# EasyEDA Pro project sonos_knobs_v1.1.eprj, board PCB5_1
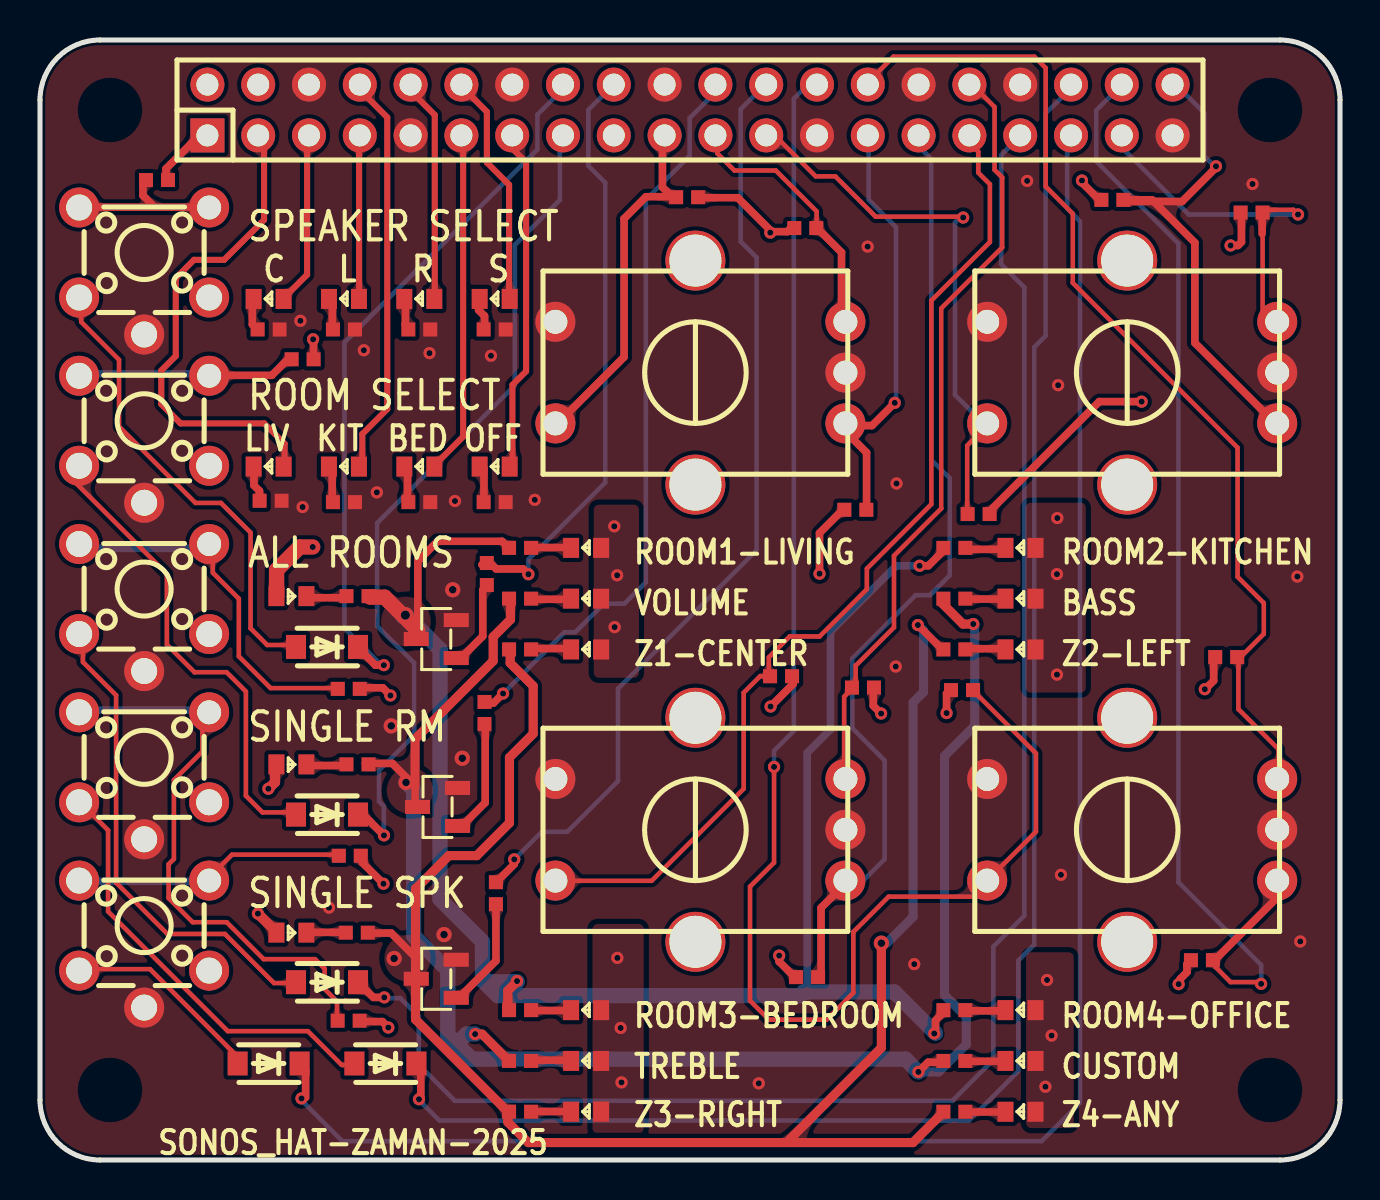
[diagram p2: board, top side]
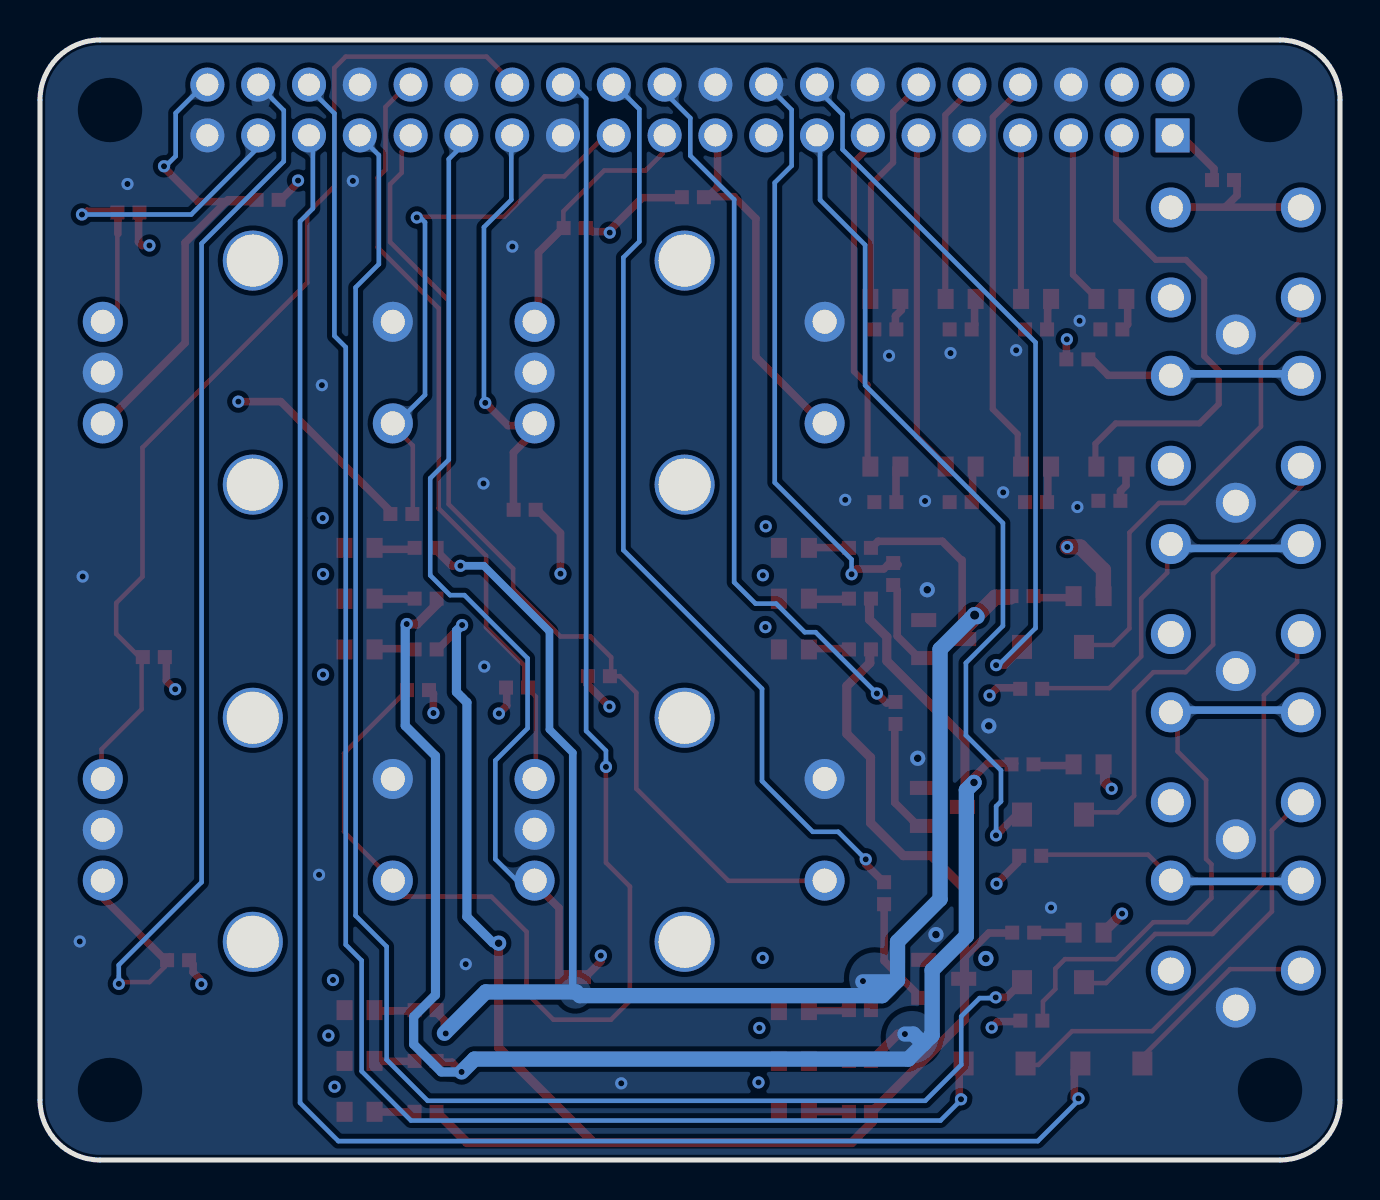
[diagram p3: board, bottom side, seen from below]

Outline 65 x 56 mm; copper layers: Top Layer, Inner1, Inner2, Bottom Layer. Coordinates in mm from the lower left corner of the outline.
Outline path: 0,53 0,3 arc(0.88,0.88) 3,0 62,0 arc(64.12,0.88) 65,3 65,53 arc(64.12,55.12) 62,56 3,56 arc(0.88,55.12) 0,53
Stack: Top Layer 0.035mm Outer layer thickness 1oz / Dielectric1 0.2104mm 7628 RC49% 8.6mil / Inner1 0.0152mm Inner layer thickness / Dielectric2 1.065mm 1.1mm H/HOZ Copper / Inner2 0.0152mm Inner layer thickness / Dielectric3 0.2104mm 7628 RC49% 8.6mil / Bottom Layer 0.035mm Outer layer thickness 1oz

## Design rules (mm)
template: Custom Config
spacing copperThickness1oz (default): track to track 0.102, other pairs 0.152 to 0.3
spacing copperThickness2oz: track to track 0.203, other pairs 0.152 to 0.3
track width copperThickness1oz (default): min 0.127, default 0.381, max 2.54
track width copperThickness2oz: min 0.203, default 0.254, max 2.54
differential pair differentialPair (default): width min 0.127, default 0.254, max 2.54; gap min 0.152, default 0.152
via viaSize (default): diameter min 0.5, default 0.61, max 10; hole min 0.3, default 0.305, max 6.299
net GND uses copperRegion2
pour e5335 uses copperRegion2

## Placement (name value [footprint] x y rotation side)
D1  SM4007PL  [SOD-123F_L2.8-W1.8-LS3.7-RD]  14.35 25.65 180 top
D2  SM4007PL  [SOD-123F_L2.8-W1.8-LS3.7-RD]  14.35 17.27 180 top
D3  SM4007PL  [SOD-123F_L2.8-W1.8-LS3.7-RD]  14.35 8.89 180 top
D4  SM4007PL  [SOD-123F_L2.8-W1.8-LS3.7-RD]  17.27 4.83 180 top
D5  SM4007PL  [SOD-123F_L2.8-W1.8-LS3.7-RD]  11.43 4.83 180 top
H1  2.54-2*20P母长PC104  [HDR-TH_40P-P2.54-V-F-R2-C20-S2.54-2]  32.5 52.5 0 top
LED1  KT-0603R  [LED0603-RD]  12.57 28.19 180 top
LED2  KT-0603R  [LED0603-RD]  27.31 30.61 0 top
LED3  KT-0603R  [LED0603-RD]  49.02 30.61 0 top
LED4  KT-0603R  [LED0603-RD]  27.31 7.49 0 top
LED5  KT-0603R  [LED0603-RD]  49.02 7.49 0 top
LED6  KT-0603R  [LED0603-RD]  12.57 19.78 180 top
LED7  KT-0603R  [LED0603-RD]  27.31 28.07 0 top
LED8  KT-0603R  [LED0603-RD]  49.02 28.07 0 top
LED9  KT-0603R  [LED0603-RD]  27.31 4.95 0 top
LED10  KT-0603R  [LED0603-RD]  49.02 4.95 0 top
LED11  KT-0603R  [LED0603-RD]  12.57 11.37 180 top
LED12  KT-0603R  [LED0603-RD]  27.31 25.53 0 top
LED13  KT-0603R  [LED0603-RD]  49.02 25.53 0 top
LED14  KT-0603R  [LED0603-RD]  27.31 2.41 0 top
LED15  KT-0603R  [LED0603-RD]  49.02 2.41 0 top
LED16  KT-0603R  [LED0603-RD]  11.43 43.05 0 top
LED17  KT-0603R  [LED0603-RD]  15.2 43.05 0 top
LED18  KT-0603R  [LED0603-RD]  18.97 43.05 0 top
LED19  KT-0603R  [LED0603-RD]  22.73 43.05 0 top
LED20  KT-0603R  [LED0603-RD]  11.43 34.67 0 top
LED21  KT-0603R  [LED0603-RD]  15.2 34.67 0 top
LED22  KT-0603R  [LED0603-RD]  18.97 34.67 0 top
LED23  KT-0603R  [LED0603-RD]  22.73 34.67 0 top
Q1  MMBT2222A 1P  [SOT-23-3_L2.9-W1.3-P1.90-LS2.4-BR]  19.81 26.05 0 top
Q2  MMBT2222A 1P  [SOT-23-3_L2.9-W1.3-P1.90-LS2.4-BR]  19.88 17.65 0 top
Q3  MMBT2222A 1P  [SOT-23-3_L2.9-W1.3-P1.90-LS2.4-BR]  19.81 9.06 0 top
R3  10kΩ  [C0402]  40.77 32.51 0 top
R4  10kΩ  [C0402]  38.26 46.6 0 top
R7  10kΩ  [C0402]  53.62 48.01 180 top
R8  10kΩ  [C0402]  60.58 47.37 180 top
R11  10kΩ  [C0402]  38.35 9.14 0 top
R12  10kΩ  [C0402]  41.15 23.62 180 top
R15  10kΩ  [C0402]  58.1 9.99 180 top
R16  10kΩ  [C0402]  59.31 25.15 180 top
R18  390Ω  [C0402]  22.34 29.3 270 top
R19  200Ω  [C0402]  15.88 28.19 180 top
R20  200Ω  [C0402]  24 30.61 0 top
R21  200Ω  [C0402]  45.72 30.61 0 top
R22  200Ω  [C0402]  24 7.49 0 top
R23  200Ω  [C0402]  45.72 7.49 0 top
R24  390Ω  [C0402]  22.22 22.35 270 top
R25  200Ω  [C0402]  15.88 19.78 180 top
R26  200Ω  [C0402]  24 28.07 0 top
R27  200Ω  [C0402]  45.72 28.07 0 top
R28  200Ω  [C0402]  24 4.95 0 top
R29  200Ω  [C0402]  45.72 4.95 0 top
R30  390Ω  [C0402]  22.8 13.34 270 top
R31  200Ω  [C0402]  15.84 11.37 180 top
R32  200Ω  [C0402]  24 25.53 0 top
R33  200Ω  [C0402]  45.72 25.53 0 top
R34  200Ω  [C0402]  24 2.41 0 top
R35  200Ω  [C0402]  45.72 2.41 0 top
R36  120Ω  [C0402]  11.43 41.53 180 top
R37  120Ω  [C0402]  15.2 41.53 180 top
R38  120Ω  [C0402]  18.97 41.53 180 top
R39  120Ω  [C0402]  22.73 41.53 180 top
R40  120Ω  [C0402]  11.53 32.96 180 top
R41  120Ω  [C0402]  15.2 32.89 180 top
R42  120Ω  [C0402]  18.97 32.89 180 top
R43  120Ω  [C0402]  22.73 32.89 180 top
R44  1kΩ  [C0402]  5.85 49 180 top
R45  1kΩ  [C0402]  13.13 40.04 180 top
R46  1kΩ  [C0402]  15.44 23.56 180 top
R48  1kΩ  [C0402]  15.43 6.97 180 top
R49  1kΩ  [C0402]  15.49 15.21 180 top
R50  1kΩ  [C0402]  32.36 48.14 0 top
R51  1kΩ  [C0402]  46.93 32.3 0 top
R52  1kΩ  [C0402]  37.05 24.19 0 top
R53  1kΩ  [C0402]  46.1 23.5 180 top
SW1  PEC12R-4230F-S0024  [SW-TH_PEC12R-4230F-S0024]  33.02 39.37 90 top
SW2  PEC12R-4230F-S0024  [SW-TH_PEC12R-4230F-S0024]  54.61 39.37 90 top
SW3  PEC12R-4230F-S0024  [SW-TH_PEC12R-4230F-S0024]  33.02 16.51 90 top
SW4  PEC12R-4230F-S0024  [SW-TH_PEC12R-4230F-S0024]  54.61 16.51 90 top
SW5  SKHHQVA010  [SW-TH_5P-L6.0-W6.0-P4.50-LS6.5]  5.21 10.8 0 top
SW6  SKHHQVA010  [SW-TH_5P-L6.0-W6.0-P4.50-LS6.5]  5.21 19.21 0 top
SW7  SKHHQVA010  [SW-TH_5P-L6.0-W6.0-P4.50-LS6.5]  5.21 27.62 0 top
SW8  SKHHQVA010  [SW-TH_5P-L6.0-W6.0-P4.50-LS6.5]  5.21 36.04 0 top
SW9  SKHHQVA010  [SW-TH_5P-L6.0-W6.0-P4.50-LS6.5]  5.21 44.45 0 top

## Footprints (pads in the part's own frame, mm; a bottom-side part is the same pattern mirrored in y, then rotated)
C0402
  rect 0.7x0.7 smd: 1(-0.55,0) 2(0.55,0)
HDR-TH_40P-P2.54-V-F-R2-C20-S2.54-2
  rect 1.7x1.7 hole 1.1: 1(-24.13,-1.27)
  round 1.7 hole 1.1: 2(-24.13,1.27) 3(-21.59,-1.27) 4(-21.59,1.27) 5(-19.05,-1.27) 6(-19.05,1.27) 7(-16.51,-1.27) 8(-16.51,1.27) 9(-13.97,-1.27) 10(-13.97,1.27) 11(-11.43,-1.27) 12(-11.43,1.27) 13(-8.89,-1.27) 14(-8.89,1.27) 15(-6.35,-1.27) 16(-6.35,1.27) 17(-3.81,-1.27) 18(-3.81,1.27) 19(-1.27,-1.27) 20(-1.27,1.27) 21(1.27,-1.27) 22(1.27,1.27) 23(3.81,-1.27) 24(3.81,1.27) 25(6.35,-1.27) 26(6.35,1.27) 27(8.89,-1.27) 28(8.89,1.27) 29(11.43,-1.27) 30(11.43,1.27) 31(13.97,-1.27) 32(13.97,1.27) 33(16.51,-1.27) 34(16.51,1.27) 35(19.05,-1.27) 36(19.05,1.27) 37(21.59,-1.27) 38(21.59,1.27) 39(24.13,-1.27) 40(24.13,1.27)
LED0603-RD
  rect 0.8x1 smd: 1(-0.75,0) 2(0.75,0)
SOD-123F_L2.8-W1.8-LS3.7-RD
  rect 1x1.2 smd: 1(-1.55,0) 2(1.55,0)
SOT-23-3_L2.9-W1.3-P1.90-LS2.4-BR
  rect 1.25x0.7 smd: 1(1,-0.95) 2(1,0.95) 3(-1,0)
SW-TH_5P-L6.0-W6.0-P4.50-LS6.5
  round 2 hole 1.3: 1(-3.25,3.175) 3(-3.25,-1.325) 4(3.25,-1.325) 5(0.002,-3.175)
  round 2 hole 1.199: 2(3.25,3.175)
SW-TH_PEC12R-4230F-S0024
  round 2 hole 1.2: 1(-2.54,7.25) 2(2.54,7.25) A(-2.54,-7.25) B(2.54,-7.25) C(0,-7.25)
  round 3 hole 2.6: 6(-5.601,0.25) 7(5.601,0.25)

## Nets
As in the schematic.

Pads without a net: SW1 6 7; SW2 6 7; SW3 6 7; SW4 6 7; SW5 4; SW6 4; SW7 4; SW8 4; SW9 4

## Via types
v1: diameter 0.61, hole 0.305, Top Layer to Bottom Layer, 71 vias
v2: diameter 0.762, hole 0.381, Top Layer to Bottom Layer, 7 vias
v3: diameter 0.813, hole 0.457, Top Layer to Bottom Layer, 1 via

## Routing (per net, layer and track width the routed paths; a pad name or vN(x,y) marks a point on that pad's centre or on a via; arc(x,y) is an arc through that point)
+3.3V: length 63.5
  Top Layer w0.381: 60.07,47.31 60.07,45.9 59.9,45.73 v1(59.53,45.73) ; 16.07,6.92 17.12,6.92 v1(17.42,6.62) ; 41.66,23.57 41.66,22.72 v1(42.06,22.32) ; 47.48,32.43 52.96,37.92 v1(55.08,37.92) ; 37.78,9.1 36.96,9.92 v1(36.96,10.22) ; v1(52.1,48.97) 52.1,48.87 52.91,48.06 ; 58.27,23.55 58.68,23.97 58.68,25.11 ; 36.58,46.42 37.36,46.42 37.59,46.64 ; 36.58,46.42 36.58,46.38 ; 36.58,46.42 34.89,48.11 32.94,48.11 32.92,48.09 ; 40.05,32.43 38.98,31.35 v1(38.98,29.32) ; v1(36.53,22.67) 37.66,23.81 37.66,24.22 37.65,24.23 ; 13.62,40.94 13.68,40.88 13.68,40.09 ; 57.01,8.81 57.01,9.05 57.35,9.39 57.35,9.79 57.5,9.94 ; 16.11,15.23 16.11,14.87 v1(17.17,13.81) ; v1(45.33,22.35) 45.33,23.32 45.49,23.49 ; 16,23.61 17.14,23.61 v1(17.52,23.23) ; 6.3,48.95 6.3,49.57 7.75,51.01 8.12,51.01
  Inner2 w0.94: 8.45,51.23 8.45,50.79 11.26,47.97 25.62,47.97 28.66,51.02 28.66,51.18
  vias: v1(13.66,41.04) v1(36.51,46.37) v1(56.93,8.79) v1(58.24,23.54)
+5V: length 6.2
  Top Layer w0.508: v1(10.9,12.32) 11.71,11.5 11.71,11.36 ; v1(11.42,18.56) 11.75,18.89 11.75,19.68
  Top Layer w0.762: v1(13.64,30.65) 12.98,30.65 11.83,29.5 11.83,28.14
  vias: v1(28.71,31.69) v1(28.73,26.64) v1(28.86,29.24) v1(28.87,10.11) v1(29.03,6.6) v1(29.07,3.88) v1(50.27,3.66) v1(50.35,9) v1(50.58,6.22) v1(50.85,29.29) v1(50.85,24.27) v1(50.87,32.1)
GND:
  vias: v1(13.02,41.96) v1(13.13,32.65) v1(14.45,12.62) v1(16.19,40.49) v1(16.84,33.38) v1(19.47,40.34) v1(20.75,32.95) v1(22.55,40.21) v1(24.74,33.01) v1(35.94,3.83) v1(41.38,45.67) v1(42.83,33.83) v1(42.79,24.67) v1(43.71,9.79) v1(49.36,48.95) v1(50.91,38.74) v1(51.05,14.26) v1(60.63,48.8) v1(62.87,29.17) v1(63.01,10.93) v2(17.56,21.71) v2(20.2,11.27) v2(20.64,28.51) v2(21.11,20.09)
ALL_ROOM_LED: length 29.8
  Top Layer w0.381: v1(24.42,29.29) 24.16,29.55 22.81,29.55 22.6,29.77 22.1,29.77 22.24,29.91 22.42,29.91
  Bottom Layer w0.229: 28.42,53.84 28.26,53.68 28.26,53.35 27.42,52.51 27.42,49.71 28.26,48.87 28.26,33.87 24.42,30.03 v1(24.42,29.29)
CLK_BASS: length 47
  Top Layer w0.381: 40.28,13.84 39.05,12.61 39.05,9.24
  Bottom Layer w0.229: 43.64,50.97 44.56,50.05 44.56,35.02 45.49,34.09 45.49,29.23 44.5,28.24 43.78,28.24 40.62,25.08 40.62,21.59 42.23,19.97 42.23,15.05 40.88,13.7 40.69,13.7
CLK_EXTRA: length 57
  Top Layer w0.229: 61.09,8.77 60.96,8.9 59.53,8.9 58.76,9.66 58.76,9.98
  Top Layer w0.381: 62.02,13.61 62.02,13.28 58.71,9.97 58.52,10.16
  Bottom Layer w0.229: 61.06,8.66 61.06,9.75 56.92,13.89 56.92,45.82 52.81,49.93 52.81,52.48 53.81,53.48
  vias: v1(61.06,8.81)
CLK_TREB: length 25.9
  Top Layer w0.381: 55.69,47.92 55.6,48.01 54.39,48.01 ; 55.69,47.92 54.47,47.92 54.39,48.01 ; 55.69,47.92 57.74,45.87 57.74,40.85 61.96,36.64 ; 55.69,47.92 57.1,47.92 58.82,49.64 58.82,49.71 ; 54.05,47.99 54.07,48.01 54.39,48.01 ; 54.39,48.01 54.38,48.02
  Bottom Layer w0.229: 56.77,53.79 58.22,52.35 58.22,50.19 58.81,49.6
  vias: v1(58.8,49.69)
CLK_VOL: length 21.4
  Top Layer w0.381: v1(42.74,37.86) 41.6,36.72 40.34,36.72 ; 40.48,36.22 41.33,35.37 41.33,32.5
  Bottom Layer w0.229: 41.37,51.66 41.44,51.59 41.44,48.01 42.8,46.64 42.8,37.92 v1(42.74,37.86)
DT_BASS: length 38.2
  Top Layer w0.229: 46.74,53.63 47.73,52.65 47.73,49.51 48.11,49.12 48.11,45.63 45.06,42.58 45.06,32.58 42.7,30.21 42.7,26.63 40.78,24.72 40.78,23.85 40.55,23.62 ; 40.6,23.55 40.21,23.16 40.21,19.23
DT_EXTRA: length 50.8
  Top Layer w0.229: 41.72,54.22 42.67,55.17 49.72,55.17 50.29,54.6 50.29,48.67 51.64,47.32 51.64,43.86 59.88,35.62 59.88,29.16 61.19,27.85 61.19,26.31 59.97,25.09 ; 59.88,25.22 59.92,25.18 59.92,22.54 61.92,20.54 61.92,19.02
DT_TREB: length 18.1
  Top Layer w0.229: v1(62.9,47.28) 62.67,47.51 61.22,47.51 ; 61.65,42 61.46,42 61.13,42.33 61.13,46.22
  Top Layer w0.381: 61.11,46.32 61.11,47.34 61.09,47.35
  Bottom Layer w0.229: 54.07,51.18 54.07,50.64 57.44,47.28 v1(62.9,47.28)
DT_VOL: length 12.3
  Top Layer w0.229: 33.87,50.74 33.87,50.33 34.72,49.47 36.79,49.47 38.83,47.43 38.83,46.53
  Top Layer w0.381: 38.85,46.61 40.08,45.38 40.08,42.31
ROOM1_LED: length 24.4
  Top Layer w0.305: 11.02,51.05 11.2,50.87 11.2,47 9.21,45.01 7.7,45.01 6.79,44.1 6.79,40.2 6.06,39.48 6.06,37.79 7.03,36.83 11.21,36.83 12.23,35.81 12.23,34.74
ROOM2_LED: length 20.2
  Top Layer w0.305: 16.14,53.89 16.14,53.35 17.36,52.13 17.36,37.55 16.12,36.3 16.12,34.72
ROOM3_LED: length 17.3
  Top Layer w0.305: 19.57,34.59 21.16,36.17 21.16,51.26
ROOM4_LED: length 17.4
  Top Layer w0.305: 23.62,51.32 23.62,50.57 24.31,49.89 24.31,39.44 23.62,38.75 23.62,34.75 23.46,34.59
SINGLE_ROOM_LED: length 46.8
  Top Layer w0.381: v1(23.71,15.03) 23.71,14.79 22.66,13.74
  Bottom Layer w0.229: v1(23.71,15.03) 25.09,16.41 26.36,16.41 28.9,18.95 28.9,23.56 35.83,30.5 35.83,45.13 35.03,45.92 35.03,52.54 36.07,53.58
SINGLE_SPK_LED: length 36.2
  Top Layer w0.381: v1(23.15,23.32) 22.68,22.86 22.26,22.86
  Bottom Layer w0.229: 33.58,53.2 32.49,52.1 32.49,50.22 30.29,48.02 30.29,28.89 29.22,27.82 28.19,27.82 26.76,26.39 26.22,26.39 v1(23.15,23.32)
SPK1_LED: length 8.7
  Top Layer w0.305: 13.35,51.21 13.35,44.27 12.15,43.06
SPK2_LED: length 8
  Top Layer w0.305: 15.96,43.09 15.96,50.86 16.14,51.05
SPK3_LED: length 10.9
  Top Layer w0.305: 18.5,53.57 18.5,53.48 19.74,52.25 19.74,43.44 19.57,43.28 19.57,43.25
SPK4_LED: length 11.5
  Top Layer w0.305: 21.26,53.49 22.34,52.41 22.34,49.87 23.45,48.76 23.45,43.23 23.7,42.98
SW_ALL_ROOM: length 35.6
  Top Layer w0.381: v1(17.19,24.74) 16.77,24.74 15.93,25.58
  Bottom Layer w0.229: 25.88,53.46 25.88,53.28 24.87,52.27 24.87,50.53 15.22,40.88 15.22,26.6 17.15,24.67
SW_BASS: length 49.6
  Top Layer w0.229: 36.44,24.19 36.47,24.19 ; 36.44,24.19 36.01,24.19 35.18,23.37 35.18,18.56 30.58,13.96 26.04,13.96 ; 36.44,24.19 36.44,25.13 37.49,26.18 38.98,26.18 41.34,28.54 41.34,29.57 44.57,32.79 44.57,42.97 47.49,45.9 47.49,48.79 46.91,49.37 46.91,50.42 46.78,50.55
SW_CHG_ROOM: length 90.7
  Top Layer w0.381: 13.05,4.7 13.28,4.47 13.28,3.12
  Bottom Layer w0.229: 13.08,2.98 15.11,0.94 50.08,0.94 52,2.86 52,46.93 51.36,47.58 51.36,50.68 51.6,50.92
  vias: v1(13.08,3.08)
SW_CHG_SPK: length 83.2
  Top Layer w0.381: 18.84,4.68 19.04,4.48 19.04,3.14
  Bottom Layer w0.229: 18.75,3.11 18.84,3.11 19.97,1.97 46.45,1.97 48.92,4.44 48.92,9.97 49.71,10.77 49.71,40.64 50.28,41.21 50.28,52.33 51.29,53.34 51.29,53.42
  vias: v1(18.95,3.04)
SW_EXTRA: length 75.9
  Top Layer w0.229: 46.71,23.41 49.8,20.33 49.8,16.42 47.38,14 ; v1(36.7,19.66) 36.7,14.87 35.5,13.67 35.5,7.96 36.45,7.02 39.33,7.02 40.67,8.36 40.67,11.41 42.43,13.17 46.89,13.17 47.46,13.73 47.46,13.83
  Bottom Layer w0.229: v1(36.7,19.66) 36.7,20.46 37.69,21.46 37.69,53.07 38.55,53.93
SW_SINGLE_ROOM: length 83.6
  Top Layer w0.381: v1(17.21,8.13) 16.67,8.13 15.98,8.82
  Bottom Layer w0.229: 17.3,8.09 18.02,8.09 18.94,7.18 18.94,4.76 20.74,2.96 45.62,2.96 47.67,5.01 47.67,10.67 49.22,12.22 49.22,43.63 48.06,44.79 48.06,50.24 48.75,50.94
SW_SINGLE_SPK: length 42.1
  Top Layer w0.381: v1(17.2,16.23) 16.07,17.36 15.91,17.36
  Bottom Layer w0.229: 17.19,16.26 17.19,17.69 16.95,17.93 16.95,19.48 18.7,21.23 18.7,24.86 16.85,26.71 16.85,31.85 23.74,38.74 23.74,45.75 26,48.01 26,51.2
SW_TREB: length 27.2
  Top Layer w0.229: 46.18,47.17 41.78,47.17 39.77,49.18 38.79,49.18 37.05,50.92 36.33,50.92 ; 46.36,32.34 46.36,35.72 47.25,36.62
  Bottom Layer w0.229: 46.01,47.14 45.75,46.89 45.75,38.25 47.29,36.72
  vias: v1(46.16,47.12)
SW_VOL: length 17.5
  Top Layer w0.381: 31.12,50.79 31.12,48.64 31.6,48.16 ; 25.81,36.76 29.2,40.15 29.2,47.07 30.3,48.16 31.6,48.16 ; 31.6,48.16 31.68,48.09
$2N553: length 4.3
  Top Layer w0.381: 22.42,28.77 22.14,28.49 22.14,26.19 21,25.05
$2N557: length 86
  Top Layer w0.381: 44.78,6.32 44.78,6.98 45.14,7.34 ; 23.44,30.6 23.1,30.94 19.88,30.94 18.95,30.01 ; v1(43.98,29.71) 44.42,29.71 45.18,30.47 ; 18.89,30.01 18.89,26.05
  Top Layer w0.457: 23.39,7.59 23.39,8.46 23.87,8.95
  Top Layer w0.762: 18.89,26.48 17.23,28.14 16.51,28.14
  Bottom Layer w0.381: 38.36,8.35 38.36,20.36 39.53,21.53 39.53,26.43 42.81,29.71 v1(43.98,29.71)
  Bottom Layer w0.762: 18.31,27.23 20,25.54 20,13.04 22.12,10.92 22.12,8.98 22.89,8.22 38,8.22 38.19,8.4 42.71,8.4 44.78,6.34 ; 18.2,27.23 18.14,27.17 ; 22.36,8.91 23.86,8.91
  vias: v1(23.85,8.95) v1(44.71,6.32) v3(18.27,27.25)
$2N567: length 2
  Top Layer w0.381: 15.3,28.11 13.29,28.11
$2N579: length 2.1
  Top Layer w0.381: 24.48,30.61 24.49,30.62 26.58,30.62
$2N581: length 2.1
  Top Layer w0.381: 48.28,30.53 46.3,30.53 46.19,30.64
$2N583: length 2.1
  Top Layer w0.381: 24.56,7.47 26.57,7.47 26.64,7.4
$2N585: length 1.9
  Top Layer w0.381: 48.22,7.44 48.2,7.46 46.29,7.46
$2N1083: length 5.9
  Top Layer w0.381: 22.26,21.92 22.26,17.87 20.97,16.58
$2N1087: length 85.2
  Top Layer w0.381: 45.15,4.89 44.41,4.89 v1(43.92,4.4) ; 18.75,17.63 18.75,18.69 17.61,19.83 16.26,19.83
  Top Layer w0.457: 18.75,18.69 18.75,21.05 22.66,24.95 22.66,26.16 23.53,27.02 23.53,28.1 ; v1(46.66,26.8) 46.14,26.8 45.11,27.83 45.11,28.06 ; v1(21.75,6.3) 22.1,6.3 23.33,5.07
  Bottom Layer w0.457: v1(46.66,26.8) 46.74,26.73 46.74,21.72 45.23,20.2 45.23,8.25 46.32,7.16 46.32,5.78 44.93,4.4 v1(43.92,4.4)
  Bottom Layer w0.762: 20.83,5.8 21.33,6.3 v1(21.75,6.3) ; 20.83,5.8 21.59,5.05 43.28,5.05 v1(43.92,4.4) ; 20.83,5.8 20.46,6.17 ; 20.46,6.17 20.39,6.24 20.39,9.49 18.68,11.2 18.68,18.5 v2(18.3,18.88) ; 20.46,6.17 20.46,6.24
$2N1097: length 2.1
  Top Layer w0.381: 13.29,19.72 15.27,19.72 15.33,19.78
$2N1109: length 2
  Top Layer w0.381: 24.52,27.98 24.57,28.04 26.41,28.04 26.49,28.12
$2N1111: length 1.9
  Top Layer w0.381: 48.25,28.05 46.37,28.05
$2N1113: length 2.1
  Top Layer w0.381: 26.54,4.99 24.54,4.99 24.51,4.96
$2N1115: length 2
  Top Layer w0.381: 46.29,4.94 48.27,4.94
$2N1613: length 5.5
  Top Layer w0.381: 22.8,12.85 22.8,9.96 20.95,8.11
$2N1617: length 85.6
  Top Layer w0.381: 45.18,25.57 45.07,25.57 v1(43.9,26.75) ; 18.78,10.13 17.56,11.35 16.43,11.35
  Top Layer w0.457: 18.8,13.58 20.44,15.22 21.84,15.22 23.47,16.85 23.47,20.13 24.66,21.31 24.66,23.7 23.51,24.85 23.51,25.61 23.52,25.62 ; v2(42.07,10.84) 42.07,5.61 37.41,0.96 ; 45.18,2.4 43.65,0.87 24.41,0.87 23.39,1.89 23.39,2.34 ; 18.78,13.58 18.78,7.02 ; 23.42,2.38 18.78,7.02
  Bottom Layer w0.457: v1(43.9,26.75) 44.18,26.47 44.18,23.4 43.65,22.88 43.65,12.16 42.36,10.86 42.09,10.86 v2(42.07,10.84)
  vias: v2(17.71,10.07)
$2N1627: length 2
  Top Layer w0.381: 15.4,11.38 13.38,11.38 13.36,11.4
$2N1639: length 2
  Top Layer w0.381: 26.51,25.54 26.47,25.57 24.53,25.57
$2N1641: length 2
  Top Layer w0.381: 48.25,25.56 46.28,25.56 46.26,25.58
$2N1643: length 2
  Top Layer w0.381: 24.54,2.42 26.5,2.42 26.52,2.41
$2N1645: length 2
  Top Layer w0.381: 48.38,2.36 48.34,2.4 46.36,2.4
$2N2275: length 1.6
  Top Layer w0.381: 10.9,41.49 10.62,41.78 10.62,42.95
$2N2279: length 1.4
  Top Layer w0.381: 14.62,41.55 14.62,42.61 14.38,42.85
$2N2284: length 1.3
  Top Layer w0.381: 18.4,41.65 18.27,41.78 18.27,42.88
$2N2289: length 1.5
  Top Layer w0.381: 21.93,43.01 21.93,42.5 22.23,42.2 22.23,41.61
$2N2294: length 1.9
  Top Layer w0.381: 10.72,34.69 10.7,34.67 10.7,33.73 10.97,33.45 10.97,32.89
$2N2299: length 1.8
  Top Layer w0.381: 14.61,32.85 14.61,34.48 14.5,34.59
$2N2307: length 1.5
  Top Layer w0.381: 18.25,33.06 18.37,33.18 18.37,34.55
$2N2312: length 1.8
  Top Layer w0.381: 22.2,32.92 22.2,34.57 22.05,34.71
$2N6344: length 8
  Top Layer w0.381: 5.15,49.12 5.15,48.23 5.7,47.68 ; 2,47.64 8.15,47.64 8.28,47.77
$2N6348: length 11.1
  Top Layer w0.381: 12.48,40.12 11.59,39.23 8.7,39.23
  Bottom Layer w0.381: 8.36,39.19 8.24,39.31 1.48,39.31
$2N6353: length 17.9
  Top Layer w0.229: 14.83,23.59 11.53,23.59 9.94,25.18 9.94,28.07 8.64,29.37 8.64,30.71
  Bottom Layer w0.381: 1.93,30.58 7.96,30.58 8.16,30.78
$2N6358: length 13.2
  Top Layer w0.229: 15.18,15.27 9.6,15.27 8.66,14.33
  Bottom Layer w0.381: 2.15,13.93 8.36,13.93 8.42,13.99
$2N6363: length 27.9
  Top Layer w0.229: 8.12,21.79 8.12,20.43 6.69,19 6.69,15.05 6.43,14.79 6.43,13.1 7.64,11.89 9.34,11.89 11.18,10.04 13.75,10.04 14.23,9.56 14.23,8.55 14.85,7.93 14.85,6.99
  Bottom Layer w0.381: 1.97,22.5 8.12,22.5 8.32,22.3
$2N6573: length 22.8
  Top Layer w0.229: 2.06,42.55 2.06,41.9 3.95,40.01 3.95,36.67 7.77,32.85 9.05,32.85 10.53,31.37 10.53,26.58 11.36,25.75 12.82,25.75
$2N6576: length 23.9
  Top Layer w0.229: 1.52,34.74 1.52,34.13 6.34,29.3 6.34,25.77 7.72,24.39 9.33,24.39 10.3,23.42 10.3,18.21 11.13,17.38 12.78,17.38
$2N6578: length 24.1
  Top Layer w0.229: 12.79,8.81 12.75,8.85 11.7,8.85 9.25,11.3 6.37,11.3 3.8,13.87 3.8,23.24 2.15,24.9 2.15,26.22
$2N6580: length 9.9
  Top Layer w0.229: 9.95,5.09 5.5,9.54 1.93,9.54
$2N6582: length 21.6
  Top Layer w0.229: 15.71,4.66 15.69,4.69 15.69,4.75 15.08,4.75 13.4,6.44 9.39,6.44 3.4,12.43 3.4,16.49 1.98,17.91

## Copper pours and planes (outline as drawn; the poured copper is in the pictures)
+3.3V on Inner2: 15.39,30.28 15.41,30.38 15.47,30.46 15.55,30.51 15.65,30.53 25.29,30.53 25.39,30.51 25.47,30.46 25.53,30.38 25.55,30.28 25.55,-5.77 25.53,-5.87 25.47,-5.95 25.39,-6.01 25.29,-6.03 15.65,-6.03 15.55,-6.01 15.47,-5.95 15.41,-5.87 15.39,-5.77
+3.3V on Inner2: 12.91,57.61 12.93,57.7 12.98,57.79 13.06,57.84 13.16,57.86 66.32,57.86 66.42,57.84 66.5,57.79 66.56,57.7 66.58,57.61 66.58,39.84 66.56,39.74 66.5,39.66 66.42,39.61 66.32,39.59 13.16,39.59 13.06,39.61 12.98,39.66 12.93,39.74 12.91,39.84
+3.3V on Inner2: 6.86,51.87 6.88,51.98 6.93,52.09 7.02,52.18 7.13,52.23 7.24,52.25 8.92,52.25 9.03,52.23 9.14,52.18 9.23,52.09 9.29,51.98 9.3,51.87 9.3,50.41 9.29,50.31 9.23,50.19 9.14,50.1 9.03,50.05 8.92,50.03 7.24,50.03 7.13,50.05 7.02,50.1 6.93,50.19 6.88,50.31 6.86,50.41
+3.3V on Inner2: 31.45,30.46 31.47,30.56 31.52,30.64 31.6,30.69 31.7,30.71 45.99,30.71 46.09,30.69 46.17,30.64 46.23,30.56 46.25,30.46 46.25,-3.78 46.23,-3.88 46.17,-3.96 46.09,-4.02 45.99,-4.03 31.7,-4.03 31.6,-4.02 31.52,-3.96 31.47,-3.88 31.45,-3.78
+3.3V on Inner2: 52.24,41.32 52.26,41.42 52.31,41.5 52.4,41.55 52.49,41.57 66.26,41.57 66.36,41.55 66.44,41.5 66.5,41.42 66.52,41.32 66.52,-1.31 66.5,-1.4 66.44,-1.49 66.36,-1.54 66.26,-1.56 52.49,-1.56 52.4,-1.54 52.31,-1.49 52.26,-1.4 52.24,-1.31
+3.3V on Inner2: -3.25,30.34 -3.23,30.44 -3.18,30.52 -3.09,30.57 -3,30.59 8.84,30.59 8.94,30.57 9.02,30.52 9.08,30.44 9.1,30.34 9.1,-5.23 9.08,-5.33 9.02,-5.41 8.94,-5.46 8.84,-5.48 -3,-5.48 -3.09,-5.46 -3.18,-5.41 -3.23,-5.33 -3.25,-5.23
+3.3V on Inner2: -7.96,4.12 -7.94,4.21 -7.88,4.3 -7.8,4.35 -7.7,4.37 55.59,4.37 55.68,4.35 55.77,4.3 55.82,4.21 55.84,4.12 55.84,-6.13 55.82,-6.23 55.77,-6.31 55.68,-6.37 55.59,-6.39 -7.7,-6.39 -7.8,-6.37 -7.88,-6.31 -7.94,-6.23 -7.96,-6.13
+3.3V on Inner2: 9.35,6.52 9.37,6.62 9.42,6.7 9.5,6.75 9.6,6.77 15.36,6.77 15.46,6.75 15.54,6.7 15.59,6.62 15.61,6.52 15.61,-8.45 15.59,-8.54 15.54,-8.63 15.46,-8.68 15.36,-8.7 9.6,-8.7 9.5,-8.68 9.42,-8.63 9.37,-8.54 9.35,-8.45
+3.3V on Inner2: 17.17,47.78 17.13,48.07 17.06,48.35 16.95,48.62 16.8,48.87 16.62,49.1 16.42,49.31 16.19,49.49 15.93,49.63 15.66,49.74 15.38,49.82 15.09,49.86 14.8,49.86 14.51,49.82 14.23,49.74 13.96,49.63 13.71,49.49 13.48,49.31 13.27,49.1 13.09,48.87 12.95,48.62 12.84,48.35 12.76,48.07 12.72,47.78 12.72,47.49 12.76,47.2 12.84,46.92 12.95,46.65 13.09,46.39 13.27,46.16 13.48,45.96 13.71,45.78 13.96,45.63 14.23,45.52 14.51,45.45 14.8,45.41 15.09,45.41 15.38,45.45 15.66,45.52 15.93,45.63 16.19,45.78 16.42,45.96 16.62,46.16 16.8,46.39 16.95,46.65 17.06,46.92 17.13,47.2 17.17,47.49
+5V on Top Layer: 49.31,10.13 49.32,10.23 49.38,10.31 49.46,10.37 49.56,10.39 51.44,10.39 51.53,10.37 51.61,10.31 51.67,10.23 51.69,10.13 51.69,1.85 51.67,1.76 51.61,1.67 51.53,1.62 51.44,1.6 49.56,1.6 49.46,1.62 49.38,1.67 49.32,1.76 49.31,1.85
+5V on Top Layer: 27.62,11.55 27.64,11.64 27.7,11.73 27.78,11.78 27.88,11.8 29.93,11.8 30.03,11.78 30.11,11.73 30.17,11.64 30.19,11.55 30.19,1.59 30.17,1.49 30.11,1.41 30.03,1.36 29.93,1.34 27.88,1.34 27.78,1.36 27.7,1.41 27.64,1.49 27.62,1.59
+5V on Top Layer: 27.69,32.51 27.71,32.61 27.76,32.69 27.84,32.75 27.94,32.77 29.69,32.77 29.79,32.75 29.87,32.69 29.93,32.61 29.95,32.51 29.95,24.36 29.93,24.26 29.87,24.18 29.79,24.13 29.69,24.11 27.94,24.11 27.84,24.13 27.76,24.18 27.71,24.26 27.69,24.36
+5V on Top Layer: 49.28,32.61 49.3,32.7 49.35,32.79 49.43,32.84 49.53,32.86 52.04,32.86 52.14,32.84 52.22,32.79 52.27,32.7 52.29,32.61 52.29,23.62 52.27,23.52 52.22,23.44 52.14,23.39 52.04,23.37 49.53,23.37 49.43,23.39 49.35,23.44 49.3,23.52 49.28,23.62
+5V on Inner2: 6,38.33 6.02,38.43 6.07,38.51 6.15,38.57 6.25,38.59 51.49,38.59 51.59,38.57 51.67,38.51 51.73,38.43 51.75,38.33 51.75,31.76 51.73,31.67 51.67,31.58 51.59,31.53 51.49,31.51 6.25,31.51 6.15,31.53 6.07,31.58 6.02,31.67 6,31.76
+5V on Inner2: -0.63,57.6 -0.61,57.7 -0.55,57.78 -0.47,57.83 -0.37,57.85 12.09,57.85 12.19,57.83 12.27,57.78 12.33,57.7 12.35,57.6 12.35,32.05 12.33,31.96 12.27,31.87 12.19,31.82 12.09,31.8 -0.37,31.8 -0.47,31.82 -0.55,31.87 -0.61,31.96 -0.63,32.05
+5V on Inner2: 26.52,33.23 26.54,33.32 26.6,33.41 26.68,33.46 26.78,33.48 29.9,33.48 30,33.46 30.08,33.41 30.14,33.32 30.15,33.23 30.15,5.38 30.14,5.28 30.08,5.2 30,5.15 29.9,5.13 26.78,5.13 26.68,5.15 26.6,5.2 26.54,5.28 26.52,5.38
+5V on Inner2: 10.04,36.91 10.06,37.01 10.11,37.09 10.2,37.15 10.29,37.17 14.23,37.17 14.33,37.15 14.41,37.09 14.46,37.01 14.48,36.91 14.48,7.98 14.46,7.89 14.41,7.8 14.33,7.75 14.23,7.73 10.29,7.73 10.2,7.75 10.11,7.8 10.06,7.89 10.04,7.98
+5V on Inner2: 47.26,33.41 47.28,33.5 47.33,33.59 47.42,33.64 47.51,33.66 51.58,33.66 51.68,33.64 51.76,33.59 51.81,33.5 51.83,33.41 51.83,5.2 51.81,5.1 51.76,5.02 51.68,4.96 51.58,4.95 47.51,4.95 47.42,4.96 47.33,5.02 47.28,5.1 47.26,5.2
GND on Top Layer: 81.77,30.39 81.73,31.75 81.66,33.1 81.54,34.46 81.39,35.81 81.2,37.15 80.97,38.49 80.71,39.82 80.41,41.15 80.07,42.46 79.69,43.77 79.28,45.06 78.83,46.34 78.35,47.61 77.83,48.86 77.27,50.1 76.68,51.33 76.06,52.53 75.4,53.72 74.71,54.89 73.99,56.04 73.24,57.17 72.45,58.28 71.63,59.36 70.79,60.43 69.91,61.46 69.01,62.48 68.07,63.46 67.11,64.42 66.13,65.36 65.11,66.26 64.08,67.14 63.01,67.98 61.93,68.8 60.82,69.59 59.69,70.34 58.54,71.06 57.37,71.75 56.18,72.41 54.98,73.03 53.75,73.62 52.51,74.18 51.26,74.7 49.99,75.18 48.71,75.63 47.41,76.04 46.11,76.42 44.79,76.76 43.47,77.06 42.14,77.32 40.8,77.55 39.46,77.74 38.11,77.89 36.75,78.01 35.4,78.08 34.04,78.12 32.68,78.12 31.32,78.08 29.97,78.01 28.61,77.89 27.26,77.74 25.92,77.55 24.58,77.32 23.25,77.06 21.93,76.76 20.61,76.42 19.31,76.04 18.01,75.63 16.73,75.18 15.46,74.7 14.21,74.18 12.97,73.62 11.74,73.03 10.54,72.41 9.35,71.75 8.18,71.06 7.03,70.34 5.9,69.59 4.79,68.8 3.71,67.98 2.64,67.14 1.61,66.26 0.59,65.36 -0.39,64.42 -1.35,63.46 -2.29,62.48 -3.19,61.46 -4.07,60.43 -4.91,59.36 -5.73,58.28 -6.52,57.17 -7.27,56.04 -7.99,54.89 -8.68,53.72 -9.34,52.53 -9.96,51.33 -10.55,50.1 -11.11,48.86 -11.63,47.61 -12.11,46.34 -12.56,45.06 -12.97,43.77 -13.35,42.46 -13.69,41.15 -13.99,39.82 -14.25,38.49 -14.48,37.15 -14.67,35.81 -14.82,34.46 -14.94,33.1 -15.01,31.75 -15.05,30.39 -15.05,29.03 -15.01,27.67 -14.94,26.32 -14.82,24.96 -14.67,23.62 -14.48,22.27 -14.25,20.93 -13.99,19.6 -13.69,18.28 -13.35,16.96 -12.97,15.66 -12.56,14.36 -12.11,13.08 -11.63,11.81 -11.11,10.56 -10.55,9.32 -9.96,8.09 -9.34,6.89 -8.68,5.7 -7.99,4.53 -7.27,3.38 -6.52,2.25 -5.73,1.14 -4.91,0.06 -4.07,-1 -3.19,-2.04 -2.29,-3.06 -1.35,-4.04 -0.39,-5 0.59,-5.94 1.61,-6.84 2.64,-7.72 3.71,-8.56 4.79,-9.38 5.9,-10.17 7.03,-10.92 8.18,-11.64 9.35,-12.33 10.54,-12.99 11.74,-13.61 12.97,-14.2 14.21,-14.76 15.46,-15.28 16.73,-15.76 18.01,-16.21 19.31,-16.62 20.61,-17 21.93,-17.34 23.25,-17.64 24.58,-17.9 25.92,-18.13 27.26,-18.32 28.61,-18.47 29.97,-18.59 31.32,-18.66 32.68,-18.7 34.04,-18.7 35.4,-18.66 36.75,-18.59 38.11,-18.47 39.46,-18.32 40.8,-18.13 42.14,-17.9 43.47,-17.64 44.79,-17.34 46.11,-17 47.41,-16.62 48.71,-16.21 49.99,-15.76 51.26,-15.28 52.51,-14.76 53.75,-14.2 54.98,-13.61 56.18,-12.99 57.37,-12.33 58.54,-11.64 59.69,-10.92 60.82,-10.17 61.93,-9.38 63.01,-8.56 64.08,-7.72 65.11,-6.84 66.13,-5.94 67.11,-5 68.07,-4.04 69.01,-3.06 69.91,-2.04 70.79,-1 71.63,0.06 72.45,1.14 73.24,2.25 73.99,3.38 74.71,4.53 75.4,5.7 76.06,6.89 76.68,8.09 77.27,9.32 77.83,10.56 78.35,11.81 78.83,13.08 79.28,14.36 79.69,15.66 80.07,16.96 80.41,18.28 80.71,19.6 80.97,20.93 81.2,22.27 81.39,23.62 81.54,24.96 81.66,26.32 81.73,27.67 81.77,29.03
GND on Bottom Layer: 81.78,30.32 81.75,31.68 81.67,33.03 81.56,34.39 81.4,35.73 81.21,37.08 80.99,38.42 80.72,39.75 80.42,41.07 80.08,42.39 79.7,43.69 79.29,44.99 78.84,46.27 78.36,47.54 77.84,48.79 77.28,50.03 76.7,51.26 76.07,52.46 75.42,53.65 74.73,54.82 74,55.97 73.25,57.1 72.46,58.21 71.65,59.29 70.8,60.35 69.92,61.39 69.02,62.41 68.08,63.39 67.12,64.35 66.14,65.29 65.13,66.19 64.09,67.07 63.03,67.91 61.94,68.73 60.83,69.52 59.7,70.27 58.55,70.99 57.38,71.68 56.2,72.34 54.99,72.96 53.77,73.55 52.53,74.11 51.27,74.63 50,75.11 48.72,75.56 47.43,75.97 46.12,76.35 44.81,76.69 43.48,76.99 42.15,77.25 40.81,77.48 39.47,77.67 38.12,77.82 36.76,77.94 35.41,78.01 34.05,78.05 32.69,78.05 31.34,78.01 29.98,77.94 28.63,77.82 27.28,77.67 25.93,77.48 24.59,77.25 23.26,76.99 21.94,76.69 20.62,76.35 19.32,75.97 18.02,75.56 16.74,75.11 15.47,74.63 14.22,74.11 12.98,73.55 11.75,72.96 10.55,72.34 9.36,71.68 8.19,70.99 7.04,70.27 5.91,69.52 4.8,68.73 3.72,67.91 2.66,67.07 1.62,66.19 0.61,65.29 -0.38,64.35 -1.34,63.39 -2.27,62.41 -3.18,61.39 -4.05,60.35 -4.9,59.29 -5.72,58.21 -6.5,57.1 -7.26,55.97 -7.98,54.82 -8.67,53.65 -9.33,52.46 -9.95,51.26 -10.54,50.03 -11.1,48.79 -11.61,47.54 -12.1,46.27 -12.55,44.99 -12.96,43.69 -13.34,42.39 -13.68,41.07 -13.98,39.75 -14.24,38.42 -14.47,37.08 -14.66,35.73 -14.81,34.39 -14.93,33.03 -15,31.68 -15.04,30.32 -15.04,28.96 -15,27.6 -14.93,26.25 -14.81,24.89 -14.66,23.54 -14.47,22.2 -14.24,20.86 -13.98,19.53 -13.68,18.2 -13.34,16.89 -12.96,15.58 -12.55,14.29 -12.1,13.01 -11.61,11.74 -11.1,10.49 -10.54,9.25 -9.95,8.02 -9.33,6.82 -8.67,5.63 -7.98,4.46 -7.26,3.31 -6.5,2.18 -5.72,1.07 -4.9,-0.01 -4.05,-1.08 -3.18,-2.11 -2.27,-3.13 -1.34,-4.11 -0.38,-5.07 0.61,-6.01 1.62,-6.91 2.66,-7.79 3.72,-8.63 4.8,-9.45 5.91,-10.24 7.04,-10.99 8.19,-11.71 9.36,-12.4 10.55,-13.06 11.75,-13.68 12.98,-14.27 14.22,-14.83 15.47,-15.35 16.74,-15.83 18.02,-16.28 19.32,-16.69 20.62,-17.07 21.94,-17.41 23.26,-17.71 24.59,-17.97 25.93,-18.2 27.28,-18.39 28.63,-18.54 29.98,-18.66 31.34,-18.73 32.69,-18.77 34.05,-18.77 35.41,-18.73 36.76,-18.66 38.12,-18.54 39.47,-18.39 40.81,-18.2 42.15,-17.97 43.48,-17.71 44.81,-17.41 46.12,-17.07 47.43,-16.69 48.72,-16.28 50,-15.83 51.27,-15.35 52.53,-14.83 53.77,-14.27 54.99,-13.68 56.2,-13.06 57.38,-12.4 58.55,-11.71 59.7,-10.99 60.83,-10.24 61.94,-9.45 63.03,-8.63 64.09,-7.79 65.13,-6.91 66.14,-6.01 67.12,-5.07 68.08,-4.11 69.02,-3.13 69.92,-2.11 70.8,-1.08 71.65,-0.01 72.46,1.07 73.25,2.18 74,3.31 74.73,4.46 75.42,5.63 76.07,6.82 76.7,8.02 77.28,9.25 77.84,10.49 78.36,11.74 78.84,13.01 79.29,14.29 79.7,15.58 80.08,16.89 80.42,18.2 80.72,19.53 80.99,20.86 81.21,22.2 81.4,23.54 81.56,24.89 81.67,26.25 81.75,27.6 81.78,28.96
GND on Inner1: 0,53 0.01,53.26 0.06,53.61 0.15,53.94 0.28,54.27 0.45,54.57 0.65,54.86 0.88,55.12 1.14,55.35 1.43,55.55 1.73,55.72 2.06,55.85 2.39,55.94 2.74,55.99 3,56 62,56 62.26,55.99 62.61,55.94 62.94,55.85 63.27,55.72 63.57,55.55 63.86,55.35 64.12,55.12 64.35,54.86 64.55,54.57 64.72,54.27 64.85,53.94 64.94,53.61 64.99,53.26 65,53 65,3 64.99,2.74 64.94,2.39 64.85,2.06 64.72,1.73 64.55,1.43 64.35,1.14 64.12,0.88 63.86,0.65 63.57,0.45 63.27,0.28 62.94,0.15 62.61,0.06 62.26,0.01 62,0 3,0 2.74,0.01 2.39,0.06 2.06,0.15 1.73,0.28 1.43,0.45 1.14,0.65 0.88,0.88 0.65,1.14 0.45,1.43 0.28,1.73 0.15,2.06 0.06,2.39 0.01,2.74 0,3
$2N557 on Top Layer: 19.53,27.02 19.5,27.21 19.44,27.4 19.35,27.57 19.24,27.73 19.1,27.87 18.94,27.98 18.77,28.07 18.59,28.13 18.39,28.16 18.2,28.16 18.01,28.13 17.82,28.07 17.65,27.98 17.49,27.87 17.35,27.73 17.24,27.57 17.15,27.4 17.09,27.21 17.06,27.02 17.06,26.83 17.09,26.63 17.15,26.45 17.24,26.28 17.35,26.12 17.49,25.98 17.65,25.87 17.82,25.78 18.01,25.72 18.2,25.69 18.39,25.69 18.59,25.72 18.77,25.78 18.94,25.87 19.1,25.98 19.24,26.12 19.35,26.28 19.44,26.45 19.5,26.63 19.53,26.83
$2N557 on Bottom Layer: 39.02,8.44 38.99,8.59 38.93,8.74 38.85,8.87 38.74,8.98 38.61,9.06 38.46,9.12 38.31,9.15 38.15,9.15 38,9.12 37.86,9.06 37.73,8.98 37.62,8.87 37.53,8.74 37.47,8.59 37.44,8.44 37.44,8.29 37.47,8.13 37.53,7.99 37.62,7.86 37.73,7.75 37.86,7.66 38,7.6 38.15,7.57 38.31,7.57 38.46,7.6 38.61,7.66 38.74,7.75 38.85,7.86 38.93,7.99 38.99,8.13 39.02,8.29
$2N557 on Bottom Layer: 24.54,9.2 24.51,9.4 24.45,9.59 24.36,9.77 24.24,9.93 24.1,10.07 23.93,10.19 23.75,10.28 23.56,10.35 23.36,10.38 23.16,10.38 22.96,10.35 22.77,10.28 22.59,10.19 22.43,10.07 22.28,9.93 22.17,9.77 22.07,9.59 22.01,9.4 21.98,9.2 21.98,9 22.01,8.8 22.07,8.6 22.17,8.43 22.28,8.26 22.43,8.12 22.59,8 22.77,7.91 22.96,7.85 23.16,7.82 23.36,7.82 23.56,7.85 23.75,7.91 23.93,8 24.1,8.12 24.24,8.26 24.36,8.43 24.45,8.6 24.51,8.8 24.54,9
$2N1087 on Top Layer: 19.65,18.56 19.62,18.74 19.56,18.92 19.48,19.08 19.37,19.22 19.24,19.35 19.1,19.46 18.94,19.54 18.76,19.6 18.58,19.63 18.4,19.63 18.22,19.6 18.05,19.54 17.89,19.46 17.74,19.35 17.61,19.22 17.51,19.08 17.43,18.92 17.37,18.74 17.34,18.56 17.34,18.38 17.37,18.2 17.43,18.03 17.51,17.87 17.61,17.72 17.74,17.59 17.89,17.49 18.05,17.4 18.22,17.35 18.4,17.32 18.58,17.32 18.76,17.35 18.94,17.4 19.1,17.49 19.24,17.59 19.37,17.72 19.48,17.87 19.56,18.03 19.62,18.2 19.65,18.38
$2N1087 on Bottom Layer: 22.71,6.24 22.67,6.44 22.61,6.64 22.52,6.82 22.4,6.99 22.25,7.14 22.08,7.26 21.9,7.35 21.7,7.42 21.5,7.45 21.29,7.45 21.09,7.42 20.89,7.35 20.71,7.26 20.54,7.14 20.4,6.99 20.28,6.82 20.18,6.64 20.12,6.44 20.09,6.24 20.09,6.03 20.12,5.83 20.18,5.64 20.28,5.45 20.4,5.28 20.54,5.14 20.71,5.02 20.89,4.92 21.09,4.86 21.29,4.83 21.5,4.83 21.7,4.86 21.9,4.92 22.08,5.02 22.25,5.14 22.4,5.28 22.52,5.45 22.61,5.64 22.67,5.83 22.71,6.03
$2N1617 on Top Layer: 19.53,10.18 19.5,10.36 19.44,10.53 19.36,10.69 19.25,10.84 19.13,10.97 18.98,11.08 18.82,11.16 18.64,11.21 18.47,11.24 18.28,11.24 18.1,11.21 17.93,11.16 17.77,11.08 17.62,10.97 17.5,10.84 17.39,10.69 17.31,10.53 17.25,10.36 17.22,10.18 17.22,10 17.25,9.82 17.31,9.65 17.39,9.49 17.5,9.34 17.62,9.21 17.77,9.1 17.93,9.02 18.1,8.97 18.28,8.94 18.47,8.94 18.64,8.97 18.82,9.02 18.98,9.1 19.13,9.21 19.25,9.34 19.36,9.49 19.44,9.65 19.5,9.82 19.53,10

Small or netless copper shapes (teardrops, artwork), in the pictures only: 211 on Top Layer, 45 on Bottom Layer, 2 on Inner2

## Text on the board
Top Silkscreen Layer: SONOS_HAT-ZAMAN-2025 | ROOM1-LIVING | VOLUME | Z1-CENTER | ROOM3-BEDROOM | TREBLE | Z3-RIGHT | ROOM2-KITCHEN | BASS | Z2-LEFT | ROOM4-OFFICE | CUSTOM | Z4-ANY | LIV | KIT | BED | OFF | C | L | R | S | SPEAKER SELECT | ROOM SELECT | ALL ROOMS | SINGLE RM | SINGLE SPK
